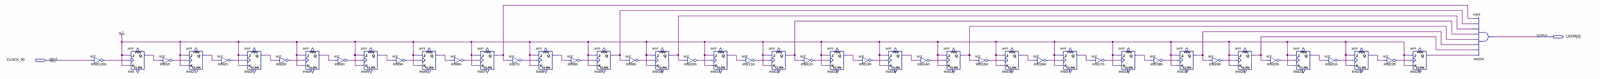
[diagram p0: schematic sheet, whole]
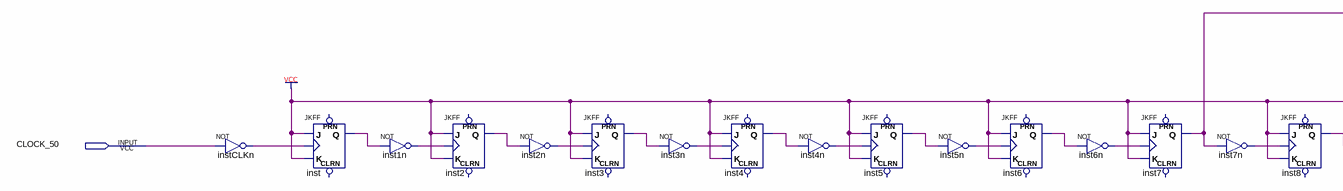
[diagram p1: schematic sheet, left part]
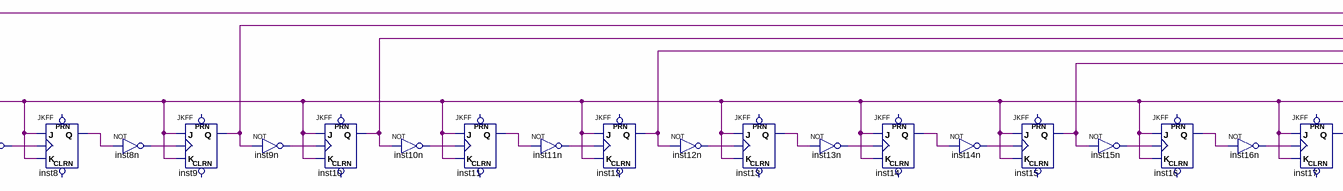
[diagram p2: schematic sheet, centre part]
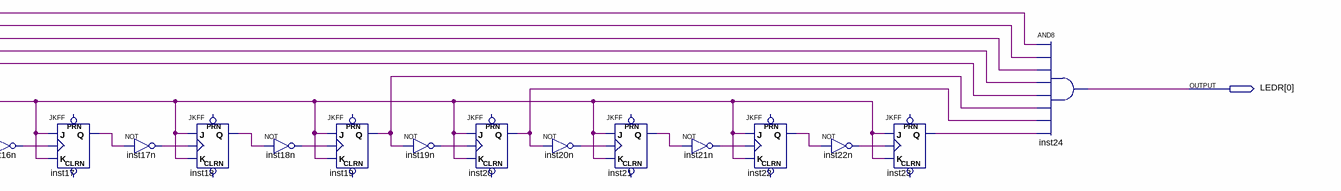
[diagram p3: schematic sheet, right part]
// Quartus schematic delic_casu.bdf as structural Verilog: 47 symbols, 2 pins
module delic_casu (
  input  CLOCK_50,
  output [0:0] LEDR
);

  wire inst1n_out, inst2_q, inst2n_out, inst3_q, inst3n_out, inst4_q, inst4n_out, inst5_q, inst5n_out,
       inst6_q, inst6n_out, inst7_q, inst7n_out, inst8_q, inst8n_out, inst9_q, inst9n_out, inst10_q,
       inst10n_out, inst11_q, inst11n_out, inst12_q, inst12n_out, inst13_q, inst13n_out, inst14_q,
       inst14n_out, inst15_q, inst15n_out, inst16_q, inst16n_out, inst17_q, inst17n_out, inst18_q,
       inst18n_out, inst19_q, inst19n_out, inst20_q, inst20n_out, inst21_q, inst21n_out, inst22_q,
       inst22n_out, inst23_q, inst_q, instCLKn_out;

  not instCLKn (instCLKn_out, CLOCK_50);
  JKFF inst (.K(1'b1), .J(1'b1), .CLK(instCLKn_out), .Q(inst_q));  // open: PRN, CLRN
  not inst1n (inst1n_out, inst_q);
  JKFF inst2 (.K(1'b1), .J(1'b1), .CLK(inst1n_out), .Q(inst2_q));  // open: PRN, CLRN
  not inst2n (inst2n_out, inst2_q);
  JKFF inst3 (.K(1'b1), .J(1'b1), .CLK(inst2n_out), .Q(inst3_q));  // open: PRN, CLRN
  not inst3n (inst3n_out, inst3_q);
  JKFF inst4 (.K(1'b1), .J(1'b1), .CLK(inst3n_out), .Q(inst4_q));  // open: PRN, CLRN
  not inst4n (inst4n_out, inst4_q);
  JKFF inst5 (.K(1'b1), .J(1'b1), .CLK(inst4n_out), .Q(inst5_q));  // open: PRN, CLRN
  not inst5n (inst5n_out, inst5_q);
  JKFF inst6 (.K(1'b1), .J(1'b1), .CLK(inst5n_out), .Q(inst6_q));  // open: PRN, CLRN
  not inst6n (inst6n_out, inst6_q);
  JKFF inst7 (.K(1'b1), .J(1'b1), .CLK(inst6n_out), .Q(inst7_q));  // open: PRN, CLRN
  not inst7n (inst7n_out, inst7_q);
  JKFF inst8 (.K(1'b1), .J(1'b1), .CLK(inst7n_out), .Q(inst8_q));  // open: PRN, CLRN
  not inst8n (inst8n_out, inst8_q);
  JKFF inst9 (.K(1'b1), .J(1'b1), .CLK(inst8n_out), .Q(inst9_q));  // open: PRN, CLRN
  not inst9n (inst9n_out, inst9_q);
  JKFF inst10 (.K(1'b1), .J(1'b1), .CLK(inst9n_out), .Q(inst10_q));  // open: PRN, CLRN
  not inst10n (inst10n_out, inst10_q);
  JKFF inst11 (.K(1'b1), .J(1'b1), .CLK(inst10n_out), .Q(inst11_q));  // open: PRN, CLRN
  not inst11n (inst11n_out, inst11_q);
  JKFF inst12 (.K(1'b1), .J(1'b1), .CLK(inst11n_out), .Q(inst12_q));  // open: PRN, CLRN
  not inst12n (inst12n_out, inst12_q);
  JKFF inst13 (.K(1'b1), .J(1'b1), .CLK(inst12n_out), .Q(inst13_q));  // open: PRN, CLRN
  not inst13n (inst13n_out, inst13_q);
  JKFF inst14 (.K(1'b1), .J(1'b1), .CLK(inst13n_out), .Q(inst14_q));  // open: PRN, CLRN
  not inst14n (inst14n_out, inst14_q);
  JKFF inst15 (.K(1'b1), .J(1'b1), .CLK(inst14n_out), .Q(inst15_q));  // open: PRN, CLRN
  not inst15n (inst15n_out, inst15_q);
  JKFF inst16 (.K(1'b1), .J(1'b1), .CLK(inst15n_out), .Q(inst16_q));  // open: PRN, CLRN
  not inst16n (inst16n_out, inst16_q);
  JKFF inst17 (.K(1'b1), .J(1'b1), .CLK(inst16n_out), .Q(inst17_q));  // open: PRN, CLRN
  not inst17n (inst17n_out, inst17_q);
  JKFF inst18 (.K(1'b1), .J(1'b1), .CLK(inst17n_out), .Q(inst18_q));  // open: PRN, CLRN
  not inst18n (inst18n_out, inst18_q);
  JKFF inst19 (.K(1'b1), .J(1'b1), .CLK(inst18n_out), .Q(inst19_q));  // open: PRN, CLRN
  not inst19n (inst19n_out, inst19_q);
  JKFF inst20 (.K(1'b1), .J(1'b1), .CLK(inst19n_out), .Q(inst20_q));  // open: PRN, CLRN
  not inst20n (inst20n_out, inst20_q);
  JKFF inst21 (.K(1'b1), .J(1'b1), .CLK(inst20n_out), .Q(inst21_q));  // open: PRN, CLRN
  not inst21n (inst21n_out, inst21_q);
  JKFF inst22 (.K(1'b1), .J(1'b1), .CLK(inst21n_out), .Q(inst22_q));  // open: PRN, CLRN
  not inst22n (inst22n_out, inst22_q);
  JKFF inst23 (.K(1'b1), .J(1'b1), .CLK(inst22n_out), .Q(inst23_q));  // open: PRN, CLRN
  and inst24 (LEDR[0], inst7_q, inst9_q, inst10_q, inst12_q, inst15_q, inst19_q, inst20_q, inst23_q);
endmodule
